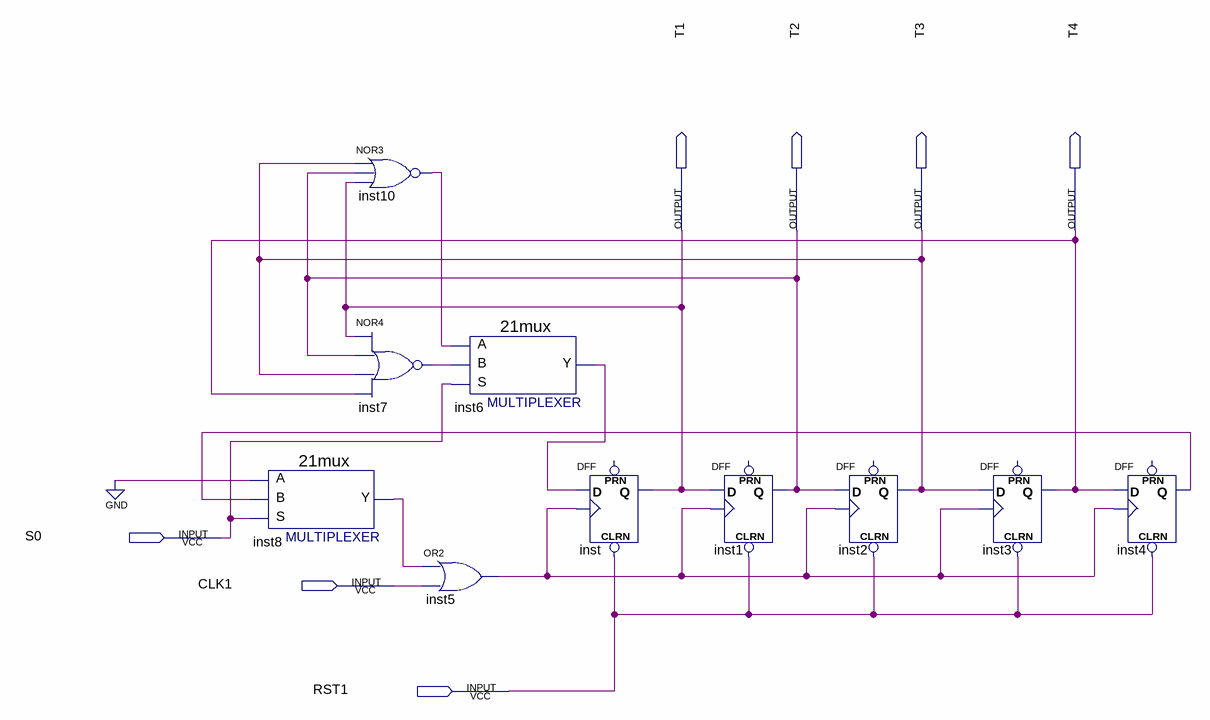
[diagram p0: schematic sheet]
// Quartus schematic Block1.bdf as structural Verilog: 10 symbols, 7 pins
module Block1 (
  input  S0,
  input  CLK1,
  input  RST1,
  output T1,
  output T2,
  output T3,
  output T4
);

  wire inst4_q, inst5_out, inst6_y, inst7_out, inst8_y, inst10_out;

  \21mux  inst8 (.S(S0), .B(inst4_q), .A(1'b0), .Y(inst8_y));
  nor inst10 (inst10_out, T3, T2, T1);
  nor inst7 (inst7_out, T1, T2, T3, T4);
  \21mux  inst6 (.S(S0), .B(inst7_out), .A(inst10_out), .Y(inst6_y));
  or inst5 (inst5_out, inst8_y, CLK1);
  DFF inst (.CLRN(RST1), .CLK(inst5_out), .D(inst6_y), .Q(T1));  // open: PRN
  DFF inst1 (.CLRN(RST1), .CLK(inst5_out), .D(T1), .Q(T2));  // open: PRN
  DFF inst2 (.CLRN(RST1), .CLK(inst5_out), .D(T2), .Q(T3));  // open: PRN
  DFF inst3 (.CLRN(RST1), .CLK(inst5_out), .D(T3), .Q(T4));  // open: PRN
  DFF inst4 (.CLRN(RST1), .CLK(inst5_out), .D(T4), .Q(inst4_q));  // open: PRN
endmodule
